# EasyEDA Pro project BLDC_DRIVER.eprj

# Schematic Schematic1
Create Date: 2024-09-19; Page Name: P1; Project Name: BLDC_DRIVER; Schematic Name: Schematic1; Update Date: 2024-09-19; Company: EasyEDA.com; Drawn: EasyEDA; Page Size: A4; Part Number: JLCPCB-002; Reviewed: EasyEDA; Version: V0.1
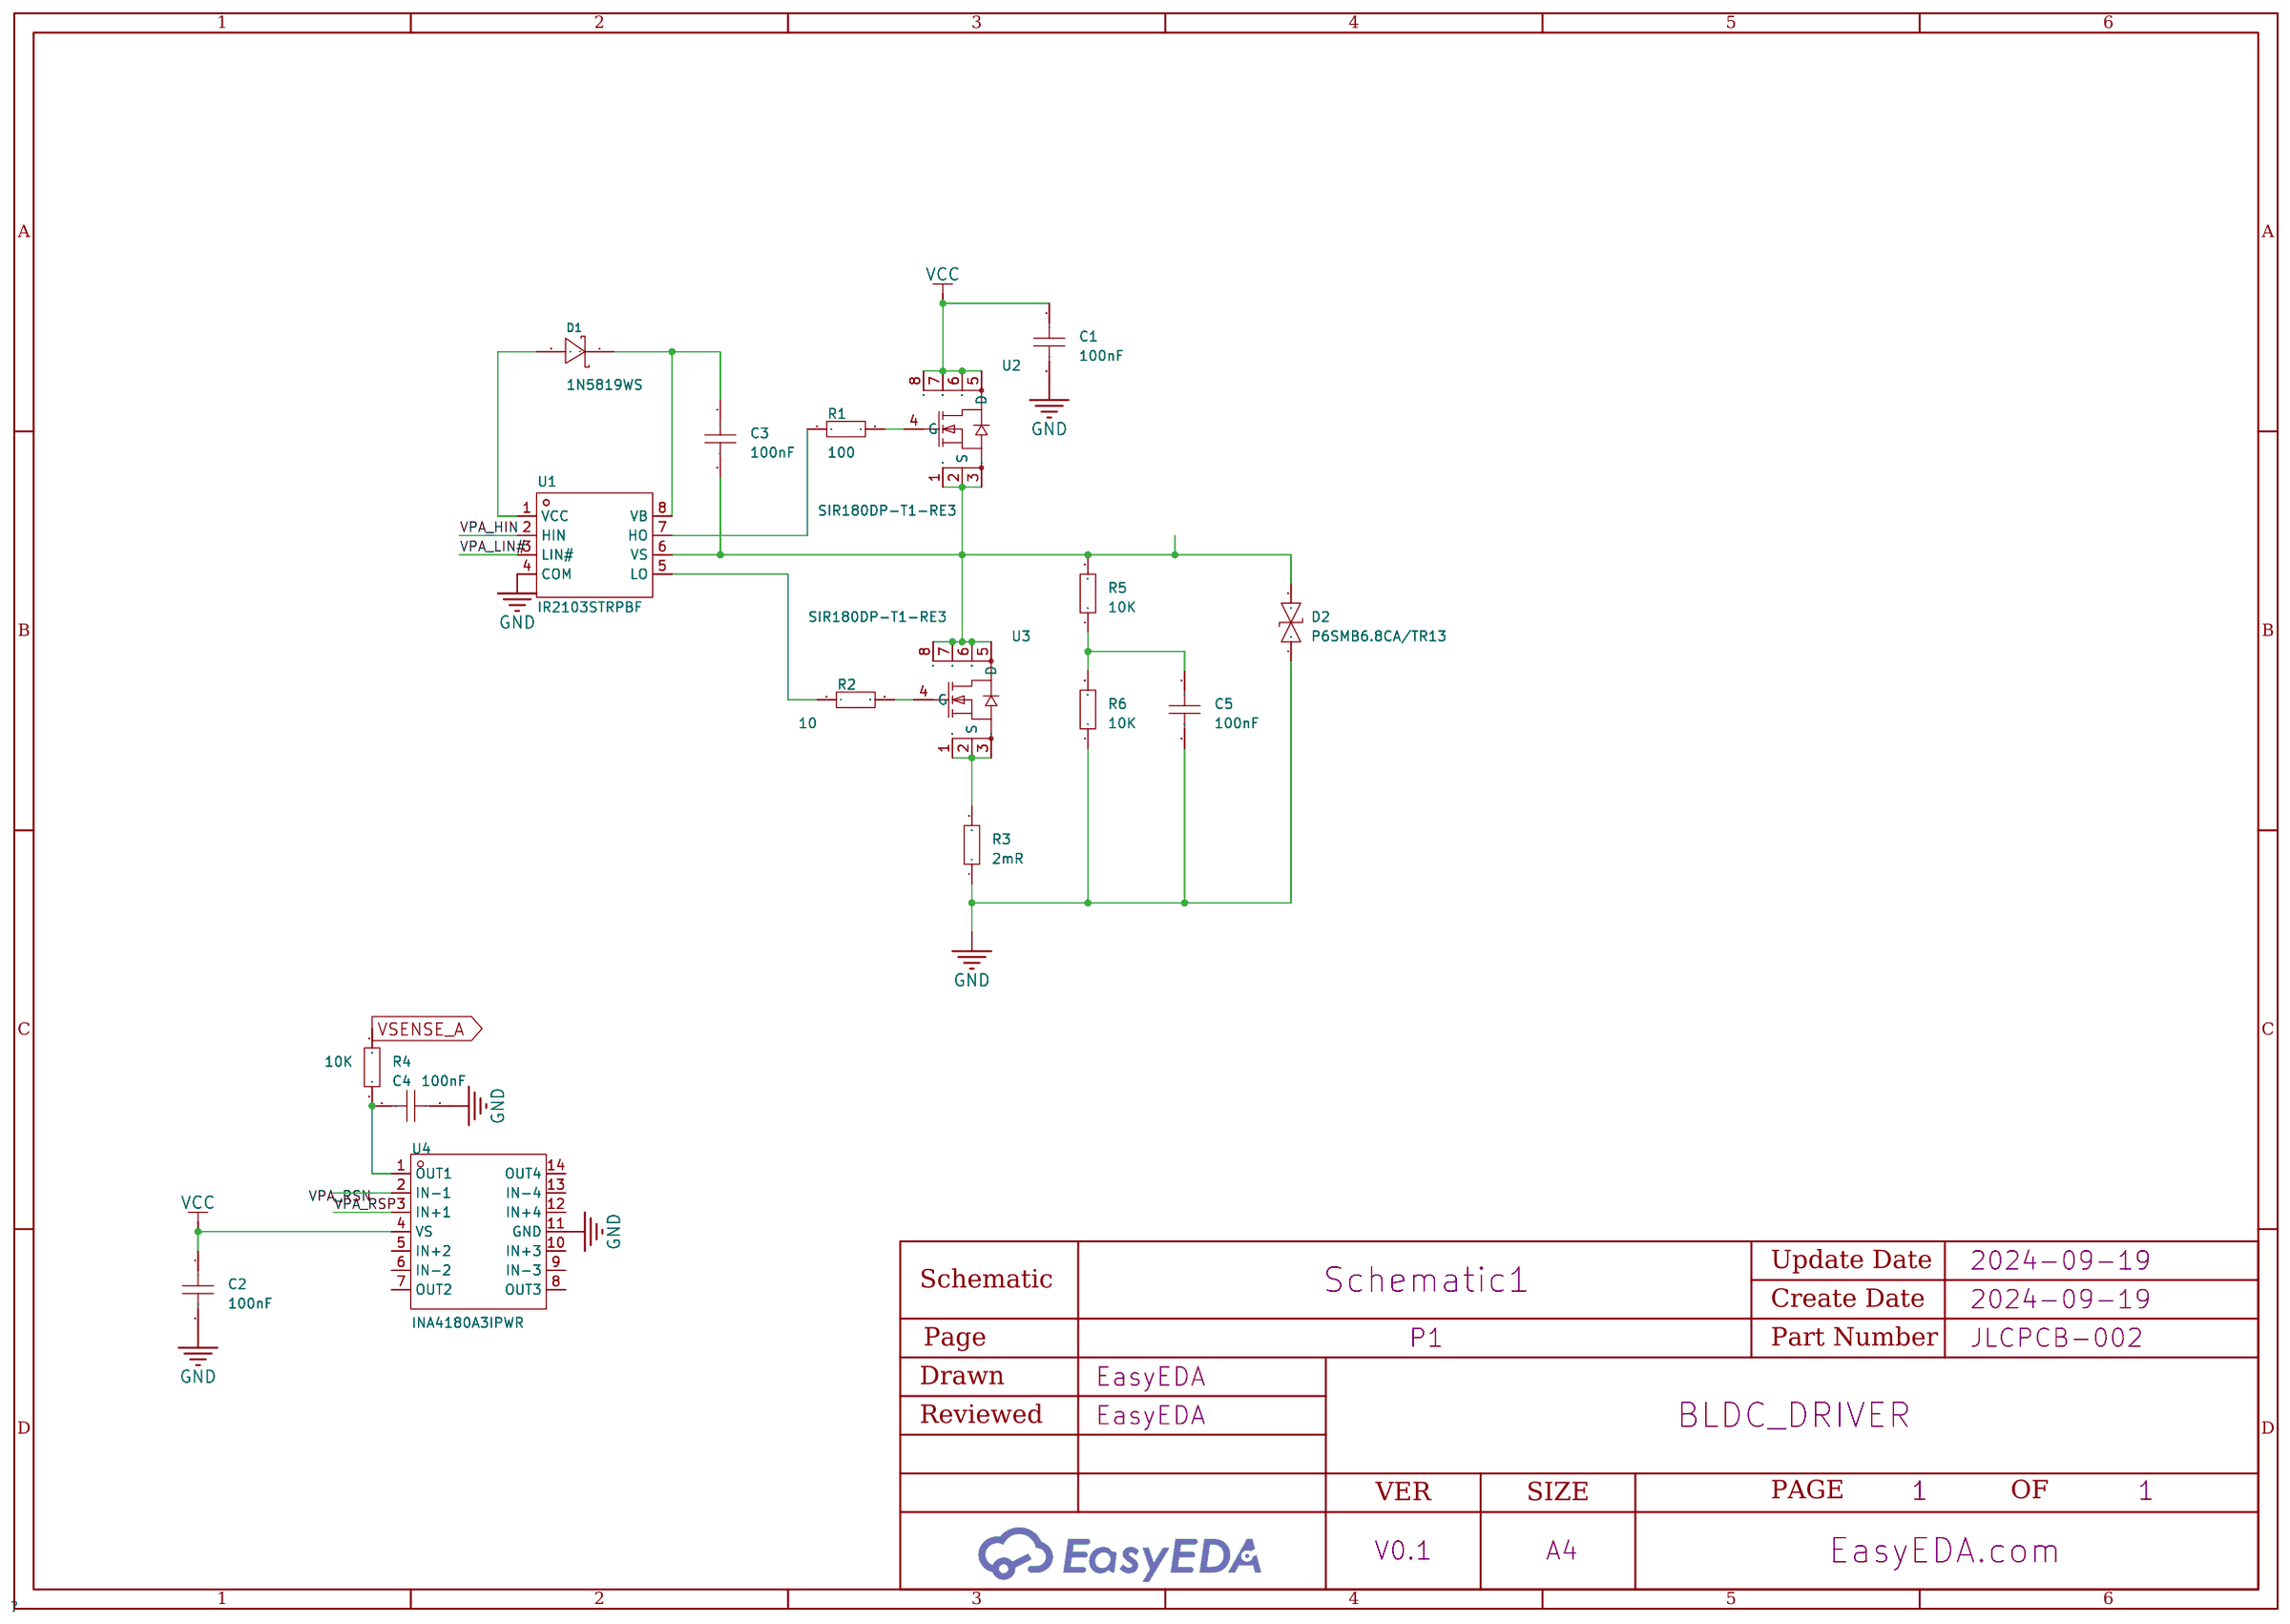
[diagram p0: schematic sheet]

## Parts
C1  100nF  [C0603]
C2  100nF  [C0603]
C3  100nF  [C0603]
C4  100nF  [C0603]
C5  100nF  [C0603]
D1  1N5819WS  [SOD-323_L1.8-W1.3-LS2.5-RD]
D2  P6SMB6.8CA/TR13  [SMB_L4.6-W3.6-LS5.3-BI]
R1  100  [R0603]
R2  10  [R0603]
R3  2mR  [R0603]
R4  10K  [R0603]
R5  10K  [R0603]
R6  10K  [R0603]
U1  IR2103STRPBF  [SOIC-8_L4.9-W3.9-P1.27-LS6.0-BL]
U2  SIR180DP-T1-RE3  [POWERPAK-SO-8_L5.9-W4.9-P1.27-LS6.2-BL]
U3  SIR180DP-T1-RE3  [POWERPAK-SO-8_L5.9-W4.9-P1.27-LS6.2-BL]
U4  INA4180A3IPWR  [TSSOP-14_L5.0-W4.4-P0.65-LS6.4-BL]

## Library data of the parts
C1-C5 = CAP_0603: Supplier Footprint: 0603
D1 = 1N5819WS_C191023: Forward Voltage (Vf@If):600mV@1A Reverse Voltage (Vr):40V Average Rectified Current (Io):1A; LCSC Part Name: 电压:40V 电流:1A; Supplier Part: C191023; Manufacturer: Hottech(合科泰); Supplier Footprint: SOD-323; JLCPCB Part Class: Basic Part; Datasheet: https://atta.szlcsc.com/upload/public/pdf/source/20220428/3CB86FD8D28D653594B4E35F9D5AEFD9.pdf; Supplier: LCSC; Forward Voltage (Vf@If): 600mV@1A; Reverse Voltage (Vr): 40V; Average Rectified Current (Io): 1A
D2 = P6SMB6.8CA/TR13: Reverse Stand-Off Voltage (Vrwm):5.8V Maximum Clamping Voltage:10.5V Peak Pulse Current (Ipp)@10/1000us:58.1A Peak Pulse Power Dissipation (Ppp)@10/1000us:600W Breakdown Voltage:6.45V Type:TVS; Supplier Part: C78395; Manufacturer: Brightking(君耀电子); Supplier Footprint: SMB(DO-214AA); JLCPCB Part Class: Basic Part; Datasheet: https://atta.szlcsc.com/upload/public/pdf/source/20160709/1468031879762.pdf; Supplier: LCSC; Reverse Stand-Off Voltage (Vrwm): 5.8V; Maximum Clamping Voltage: 10.5V; Peak Pulse Current (Ipp)@10/1000us: 58.1A; Peak Pulse Power Dissipation (Ppp)@10/1000us: 600W; Breakdown Voltage: 6.45V; Type: TVS
R1-R6 = Res_0603: Supplier Footprint: 0603
U1 = IR2103STRPBF: Driven Configuration:Half Bridge Load Type:MOSFET；IGBT Number of Drivers:2 Peak Output Current(sink):360mA Peak Output Current(source):210mA Supply Voltage:10V~20V Supply Voltage:10V~20V Rise Time:100ns Fall Time:50ns Operating Temperature:-40℃~+150℃@(Tj); Supplier Part: C2957; Manufacturer: Infineon(英飞凌); Supplier Footprint: SOIC-8; JLCPCB Part Class: Extended Part; Datasheet: https://atta.szlcsc.com/upload/public/pdf/source/20140228/1457706997637.pdf; Supplier: LCSC; Driven Configuration: Half Bridge; Load Type: MOSFET；IGBT; Number of Drivers: 2; Peak Output Current(sink): 360mA; Peak Output Current(source): 210mA; Supply Voltage: 10V~20V; Rise Time: 100ns; Fall Time: 50ns; Operating Temperature: -40℃~+150℃@(Tj)
U2 U3 = SIR180DP-T1-RE3: Type:1个NChannel Drain Source Voltage (Vdss):60V Continuous Drain Current (Id):；32.4A Power Dissipation (Pd):； Drain Source On Resistance (RDS(on)@Vgs,Id):2.05mΩ@10A,10V Gate Threshold Voltage (Vgs(th)@Id):3.6V@250uA Total Gate Charge (Qg@Vgs):87nC@10V Inp; LCSC Part Name: 1个N沟道 耐压:60V 电流:60A 电流:32.4A; Supplier Part: C5334421; Manufacturer: VISHAY(威世); Supplier Footprint: SO-8; JLCPCB Part Class: Extended Part; Datasheet: https://atta.szlcsc.com/upload/public/pdf/source/20221230/5EAF42ED79532020A551540FC13481A3.pdf; Supplier: LCSC; Type: 1个NChannel; Drain Source Voltage (Vdss): 60V; Continuous Drain Current (Id): ；32.4A; Power Dissipation (Pd): ；; Drain Source On Resistance (RDS(on)@Vgs,Id): 2.05mΩ@10A,10V; Gate Threshold Voltage (Vgs(th)@Id): 3.6V@250uA; Total Gate Charge (Qg@Vgs): 87nC@10V; Input Capacitance (Ciss@Vds): 4.03nF@30V; Operating Temperature: -55℃~+150℃@(Tj)
U4 = INA4180A3IPWR: Number of Channels:Quad Supply Current:690uA Operating Temperature:-40℃~+125℃ Operating Temperature:-40℃~+125℃; Supplier Part: C2057526; Manufacturer: TI(德州仪器); Supplier Footprint: TSSOP-14; JLCPCB Part Class: Extended Part; Datasheet: https://www.ti.com/cn/lit/gpn/ina180; Supplier: LCSC; Number of Channels: Quad; Supply Current: 690uA; Operating Temperature: -40℃~+125℃

## Nets
GND: C1.2 C2.2 C4.2 C5.2 D2.1 R3.1 R6.1 U1.4(COM) U4.11(GND)
VCC: C1.1 C2.1 U2.5(D) U2.6(D) U2.7(D) U2.8(D) U4.4(VS)
VPA_HIN: U1.2(HIN)
VPA_LIN#: U1.3(LIN#)
VPA_RSN: U4.2(IN-1)
VPA_RSP: U4.3(IN+1)
VSENSE_A: R4.1
$1N453: R1.1 U1.7(HO)
$1N458: R1.2 U2.4(G)
$1N461: R2.1 U1.5(LO)
$1N466: R2.2 U3.4(G)
$1N1072: D1.2(A) U1.1(VCC)
$1N1191: C3.1 D1.1(K) U1.8(VB)
$1N1327: C4.1 R4.2 U4.1(OUT1)
$1N1389: R3.2 U3.1(S) U3.2(S) U3.3(S)
$1N1486: C5.1 R5.1 R6.2
$1N1605: C3.2 D2.2 R5.2 U1.6(VS) U2.1(S) U2.2(S) U2.3(S) U3.5(D) U3.6(D) U3.7(D) U3.8(D)

Not connected (* = marked no-connect by the designer): U4 5(IN+2) 6(IN-2) 7(OUT2) 8(OUT3) 9(IN-3) 10(IN+3) 12(IN+4) 13(IN-4) 14(OUT4)

# Board PCB2
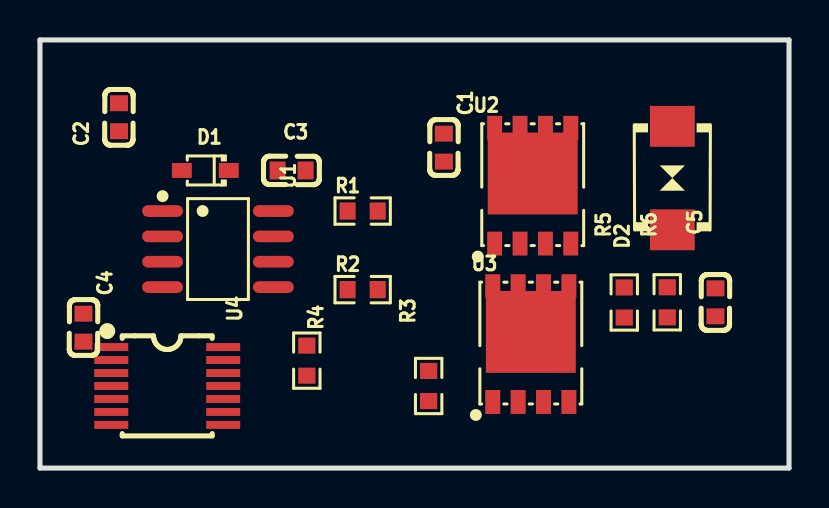
[diagram p1: board, top side]
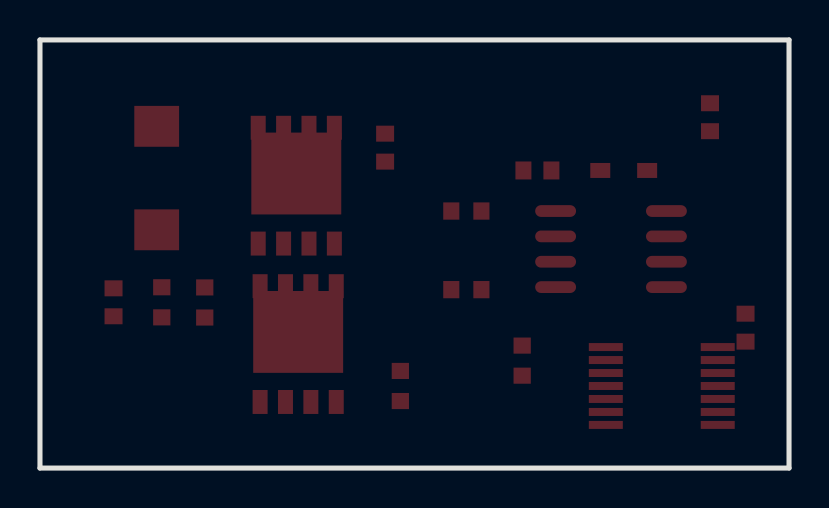
[diagram p2: board, bottom side, seen from below]

Outline 37.48 x 21.44 mm; copper layers: Top Layer, Bottom Layer. Coordinates in mm from the lower left corner of the outline.
Outline path: 0,21.44 37.48,21.44 37.48,0 0,0 0,21.44
Stack: Top Layer 0.035mm / Dielectric1 1.51mm FR4 er 4.5 / Bottom Layer 0.035mm

## Design rules (mm)
template: JLCPCB Capability(Two Layers Board)
spacing copperThickness1oz (default): track to track 0.102, other pairs 0.152 to 0.3
spacing copperThickness2oz: track to track 0.203, other pairs 0.152 to 0.3
track width copperThickness1oz (default): min 0.127, default 0.254, max 2.54
track width copperThickness2oz: min 0.203, default 0.254, max 2.54
differential pair differentialPair (default): width min 0.127, default 0.254, max 2.54; gap min 0.152, default 0.152
via viaSize (default): diameter min 0.5, default 0.61, max 10; hole min 0.3, default 0.305, max 6.3

## Placement (name value [footprint] x y rotation side)
C1  100nF  [C0603]  20.21 16.05 270 top
C2  100nF  [C0603]  3.95 17.57 90 top
C3  100nF  [C0603]  12.59 14.91 0 top
C4  100nF  [C0603]  2.18 7.03 270 top
C5  100nF  [C0603]  33.8 8.3 90 top
D1  1N5819WS  [SOD-323_L1.8-W1.3-LS2.5-RD]  8.27 14.91 180 top
D2  P6SMB6.8CA/TR13  [SMB_L4.6-W3.6-LS5.3-BI]  31.64 14.53 90 top
R1  100  [R0603]  16.15 12.87 0 top
R2  10  [R0603]  16.15 8.94 0 top
R3  2mR  [R0603]  19.45 4.11 270 top
R4  10K  [R0603]  13.35 5.38 270 top
R5  10K  [R0603]  29.24 8.29 90 top
R6  10K  [R0603]  31.39 8.3 270 top
U1  IR2103STRPBF  [SOIC-8_L4.9-W3.9-P1.27-LS6.0-BL]  8.91 10.97 270 top
U2  SIR180DP-T1-RE3  [POWERPAK-SO-8_L5.9-W4.9-P1.27-LS6.2-BL]  24.66 14.14 0 top
U3  SIR180DP-T1-RE3  [POWERPAK-SO-8_L5.9-W4.9-P1.27-LS6.2-BL]  24.56 6.21 0 top
U4  INA4180A3IPWR  [TSSOP-14_L5.0-W4.4-P0.65-LS6.4-BL]  6.37 4.11 270 top

## Footprints (pads in the part's own frame, mm; a bottom-side part is the same pattern mirrored in y, then rotated)
C0603
  rect 0.8x0.9 smd: 1(-0.7,0) 2(0.7,0)
POWERPAK-SO-8_L5.9-W4.9-P1.27-LS6.2-BL
  rect 0.75x1.2 smd: 1(-1.905,-2.9) 2(-0.635,-2.9) 3(0.635,-2.9) 4(1.905,-2.9) 5(1.905,2.9) 6(0.635,2.9) 7(-0.635,2.9) 8(-1.905,2.9)
  rect 4.5x4.1 smd: 8(0,0.609)
R0603
  rect 0.806x0.864 smd: 1(-0.753,0) 2(0.753,0)
SMB_L4.6-W3.6-LS5.3-BI
  rect 2.047x2.241 smd: 1(-2.591,0) 2(2.591,0)
SOD-323_L1.8-W1.3-LS2.5-RD
  rect 1x0.75 smd: 1(-1.173,0) 2(1.173,0)
SOIC-8_L4.9-W3.9-P1.27-LS6.0-BL
  oval 0.588x2.045 smd: 1(-1.905,-2.772) 2(-0.635,-2.772) 3(0.635,-2.772) 4(1.905,-2.772) 5(1.905,2.772) 6(0.635,2.772) 7(-0.635,2.772) 8(-1.905,2.772)
TSSOP-14_L5.0-W4.4-P0.65-LS6.4-BL
  rect 0.4x1.7 smd: 1(-1.95,-2.8) 2(-1.3,-2.8) 3(-0.65,-2.8) 4(0,-2.8) 5(0.65,-2.8) 6(1.3,-2.8) 7(1.95,-2.8) 8(1.95,2.8) 9(1.3,2.8) 10(0.65,2.8) 11(0,2.8) 12(-0.65,2.8) 13(-1.3,2.8) 14(-1.95,2.8)

## Nets
As in the schematic.

Pads without a net: U4 5 6 7 8 9 10 12 13 14
